# EAGLE design upper_final_2 (EAGLE 7.1.0)
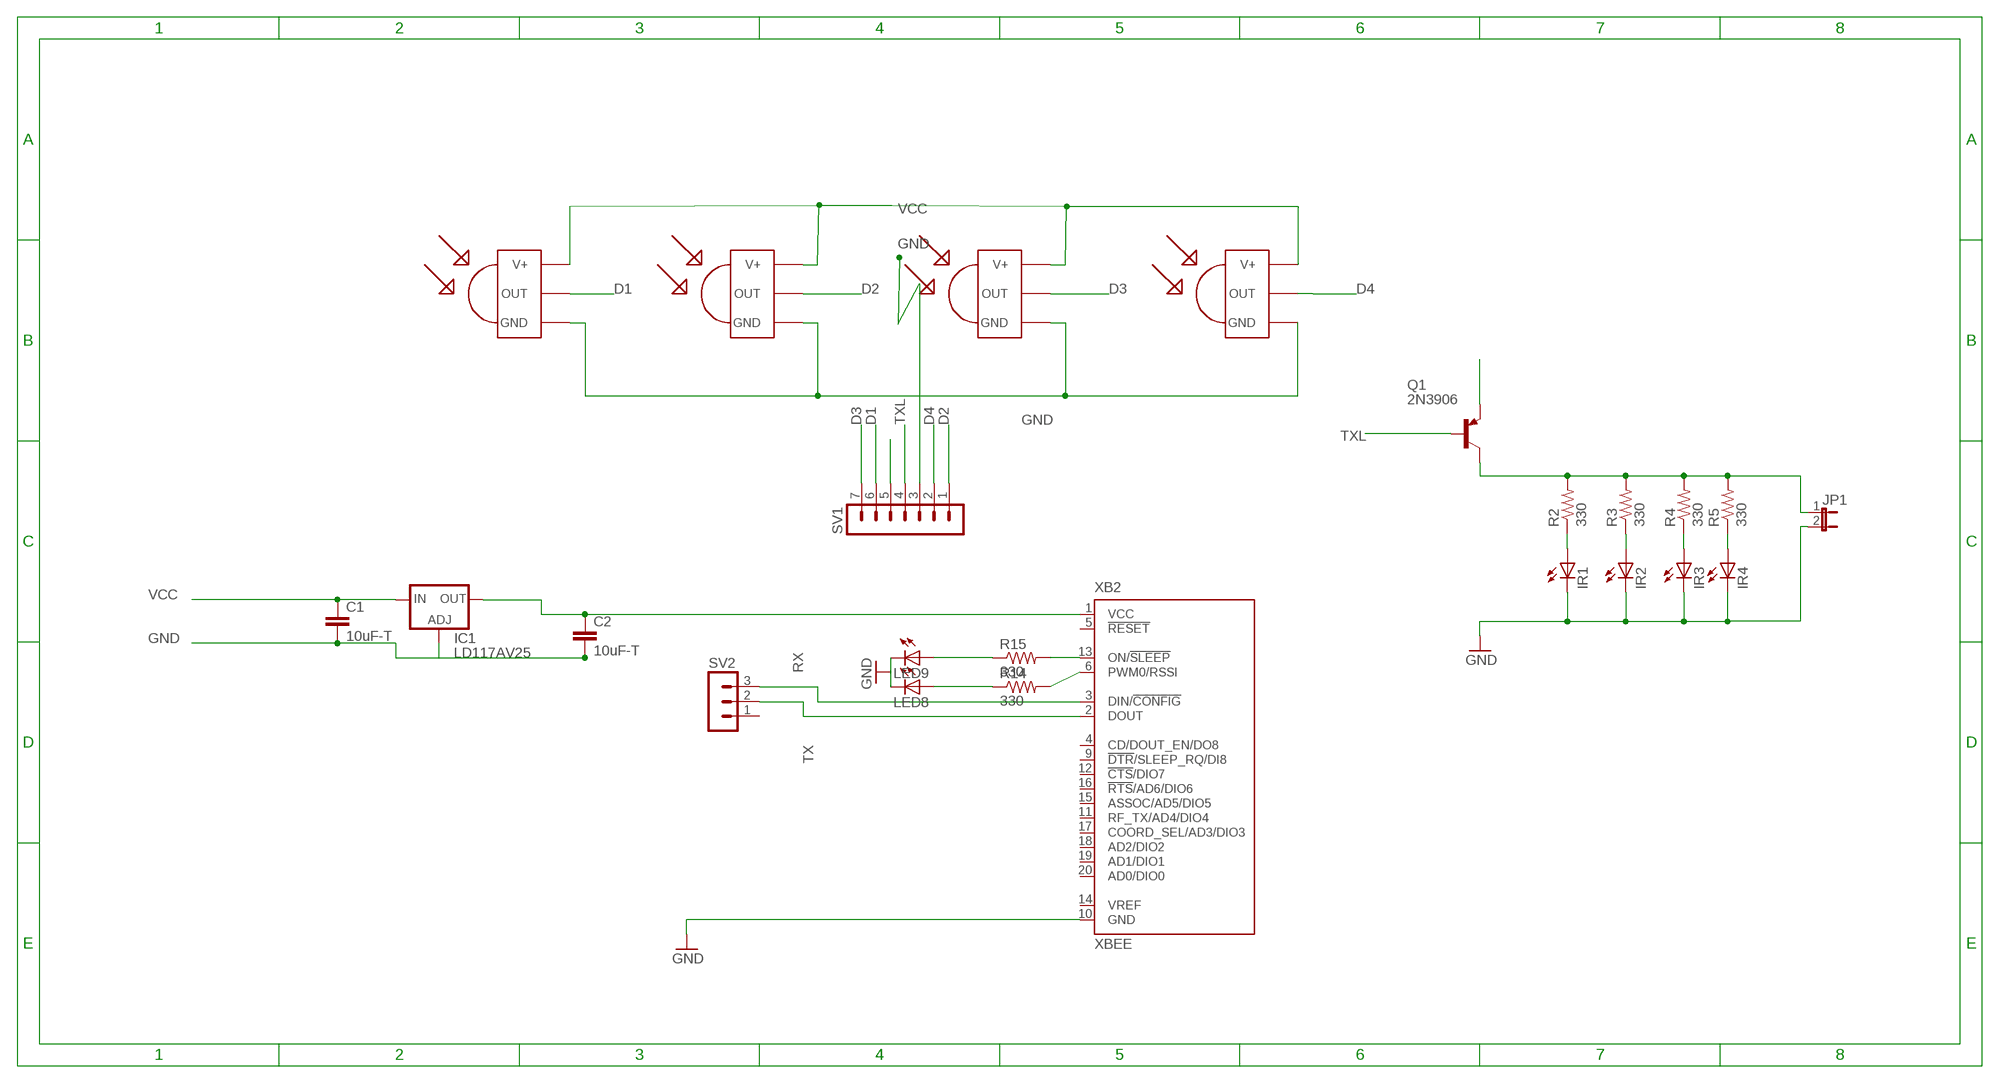
[diagram p0: schematic, sheet 1]

## Parts
C1  10uF-T  C-EU025-024X044  [C025-024X044]
C2  10uF-T  C-EU025-024X044  [C025-024X044]
IC1  LD117AV25  [TO220L1]
IR1  SFH482  [SFH482]
IR2  SFH482  [SFH482]
IR3  SFH482  [SFH482]
IR4  SFH482  [SFH482]
JP1  JP1E  [JP1]
LED8  LED3MM  [LED3MM]
LED9  LED3MM  [LED3MM]
Q1  2N3906  [TO92]
R2  330  R-US_0204/7  [0204/7]
R3  330  R-US_0204/7  [0204/7]
R4  330  R-US_0204/7  [0204/7]
R5  330  R-US_0204/7  [0204/7]
R14  330  R-US_0207/10  [0207/10]
R15  330  R-US_0207/10  [0207/10]
SV1  MA07-1  [MA07-1]
SV2  MA03-1  [MA03-1]
U$1  TSOP1738  [TSOP17XX]
U$2  TSOP1738  [TSOP17XX]
U$3  TSOP1738  [TSOP17XX]
U$4  TSOP1738  [TSOP17XX]
XB2  XBEE  [XBEE]

## Nets
D1: SV1.6 U$1.OUT
D2: SV1.1 U$2.OUT
D3: SV1.7 U$3.OUT
D4: SV1.2 U$4.OUT
GND: C1.2 C2.2 IC1.1(ADJ) IR1.K(C) IR2.K(C) IR3.K(C) IR4.K(C) JP1.2 LED8.K(C) LED9.K(C) SV1.3 U$1.GND U$2.GND U$3.GND U$4.GND XB2.10(GND)
N$3: IR1.A R2.1
N$4: IR2.A R3.1
N$5: IR3.A R4.1
N$6: IR4.A R5.1
N$7: JP1.1 Q1.1(C) R2.2 R3.2 R4.2 R5.2
N$19: R15.2 XB2.13(ON/!SLEEP)
N$29: C2.1 IC1.2(OUT) XB2.1(VCC)
N$31: LED8.A R14.1
N$32: LED9.A R15.1
N$33: R14.2 XB2.6(PWM0/RSSI)
RX: SV2.3 XB2.3(DIN/!CONFIG)
TX: SV2.2 XB2.2(DOUT)
TXL: Q1.2(B) SV1.4
VCC: C1.1 IC1.3(IN) Q1.3(E) SV1.5 U$1.V+ U$2.V+ U$3.V+ U$4.V+
Unconnected: SV2.1 XB2.4(CD/DOUT_EN/DO8) XB2.5(!RESET) XB2.9(!DTR!/SLEEP_RQ/DI8) XB2.11(RF_TX/AD4/DIO4) XB2.12(!CTS!/DIO7) XB2.14(VREF) XB2.15(ASSOC/AD5/DIO5) XB2.16(!RTS!/AD6/DIO6) XB2.17(COORD_SEL/AD3/DIO3) XB2.18(AD2/DIO2) XB2.19(AD1/DIO1) XB2.20(AD0/DIO0)

## Library data of the parts
C1 C2 = rcl:C-EU: CAPACITOR, European symbol
IC1 = v-reg:LD117A?*: Low drop fixed and adjustable positive voltage regulators 1 A Source: http://www.st.com/stonline/products/literature/ds/7194/ld1117axx.pdf
IR1-IR4 = led:SFH482: IR LED infrared emitting diode, Infineon
JP1 = jumper:JP1E: JUMPER
LED8 LED9 = led:LED: LED OSRAM: - CHIPLED LG R971, LG N971, LY N971, LG Q971, LY Q971, LO R971, LY R971 LH N974, LH R974 LS Q976, LO Q976, LY Q976 LO Q996 - Hyper CHIPLED LW Q18S LB Q993, LB Q99A, LB R99A - SideLED LS A670, LO A670, LY A670, LG A670, LP A670 LB A673, LV A673, LT A673, LW A673 LH A674 LY A675 LS A676, LA A676, LO A676, LY A676, LW A676 LS A679, LY A679, LG A679 - Hyper Micro SIDELED® LS Y876, LA Y876, LO Y876, LY Y876 LT Y87S - SmartLED LW L88C, LW L88S LB L89C, LB L89S, LG L890 LS L89K, LO L89K, LY L89K LS L896, LA L896, LO L896, LY L896 - TOPLED LS T670, LO T670, LY T670, LG T670, LP T670 LSG T670, LSP T670, LSY T670, LOP T670, LYG T670 LG T671, LOG T671, LSG T671 LB T673, LV T673, LT T673, LW T673 LH T674 LS T676, LA T676, LO T676, LY T676, LB T676, LH T676, LSB T676, LW T676 LB T67C, LV T67C, LT T67C, LS T67K, LO T67K, LY T67K, LW E67C LS E67B, LA E67B, LO E67B, LY E67B, LB E67C, LV E67C, LT E67C LW T67C LS T679, LY T679, LG T679 LS T770, LO T770, LY T770, LG T770, LP T770 LB T773, LV T773, LT T773, LW T773 LH T774 LS E675, LA E675, LY E675, LS T675 LS T776, LA T776, LO T776, LY T776, LB T776 LHGB T686 LT T68C, LB T68C - Hyper Mini TOPLED® LB M676 - Mini TOPLED Santana® LG M470 LS M47K, LO M47K, LY M47K Source: http://www.osram.convergy.de LUXEON: - LUMILED® LXK2-PW12-R00, LXK2-PW12-S00, LXK2-PW14-U00, LXK2-PW14-V00 LXK2-PM12-R00, LXK2-PM12-S00, LXK2-PM14-U00 LXK2-PE12-Q00, LXK2-PE12-R00, LXK2-PE12-S00, LXK2-PE14-T00, LXK2-PE14-U00 LXK2-PB12-K00, LXK2-PB12-L00, LXK2-PB12-M00, LXK2-PB14-N00, LXK2-PB14-P00, LXK2-PB14-Q00 LXK2-PR12-L00, LXK2-PR12-M00, LXK2-PR14-Q00, LXK2-PR14-R00 LXK2-PD12-Q00, LXK2-PD12-R00, LXK2-PD12-S00 LXK2-PH12-R00, LXK2-PH12-S00 LXK2-PL12-P00, LXK2-PL12-Q00, LXK2-PL12-R00 Source: www.luxeon.com KINGBRIGHT: KA-3528ASYC Source: www.kingbright.com
Q1 = transistor-pnp:2N3906: PNP Transistor
R2-R5 = resistor:R-US_: RESISTOR, American symbol
R14 R15 = rcl:R-US_: RESISTOR, American symbol
SV1 = con-lstb:MA07-1: PIN HEADER; OC_FARNELL: unknown; OC_NEWARK: unknown
SV2 = con-lstb:MA03-1: PIN HEADER; OC_FARNELL: unknown; OC_NEWARK: unknown
U$1-U$4 = tsop:TSOP1738: IR Receiver and Demodulator
XB2 = maxstream:XBEE: XBee (TM) /XBee-PRO(TM) OEM RF Modules Source: MaxStream, Inc. xbee_productmanual.pdf; MPN: XBP24-Z7UIT-004; OC_FARNELL: 1751799; OC_NEWARK: 34R5507

## Board
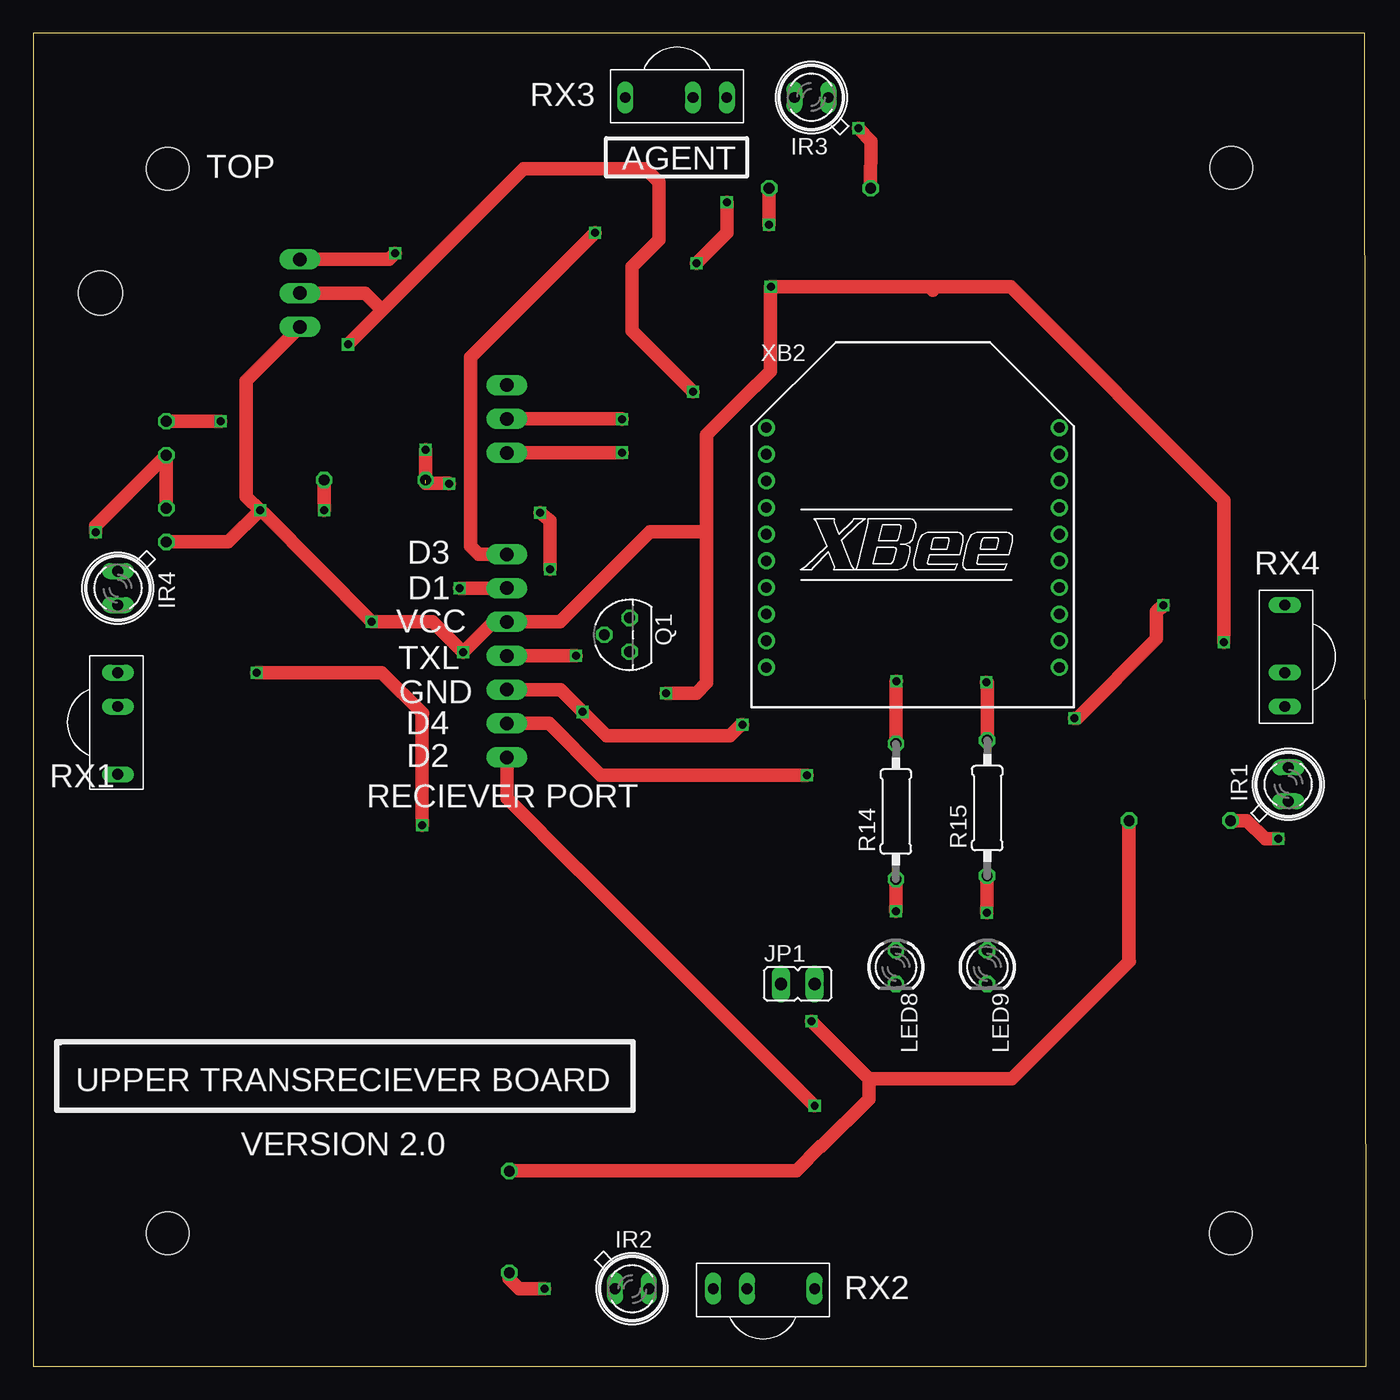
[diagram p1: board, top side]
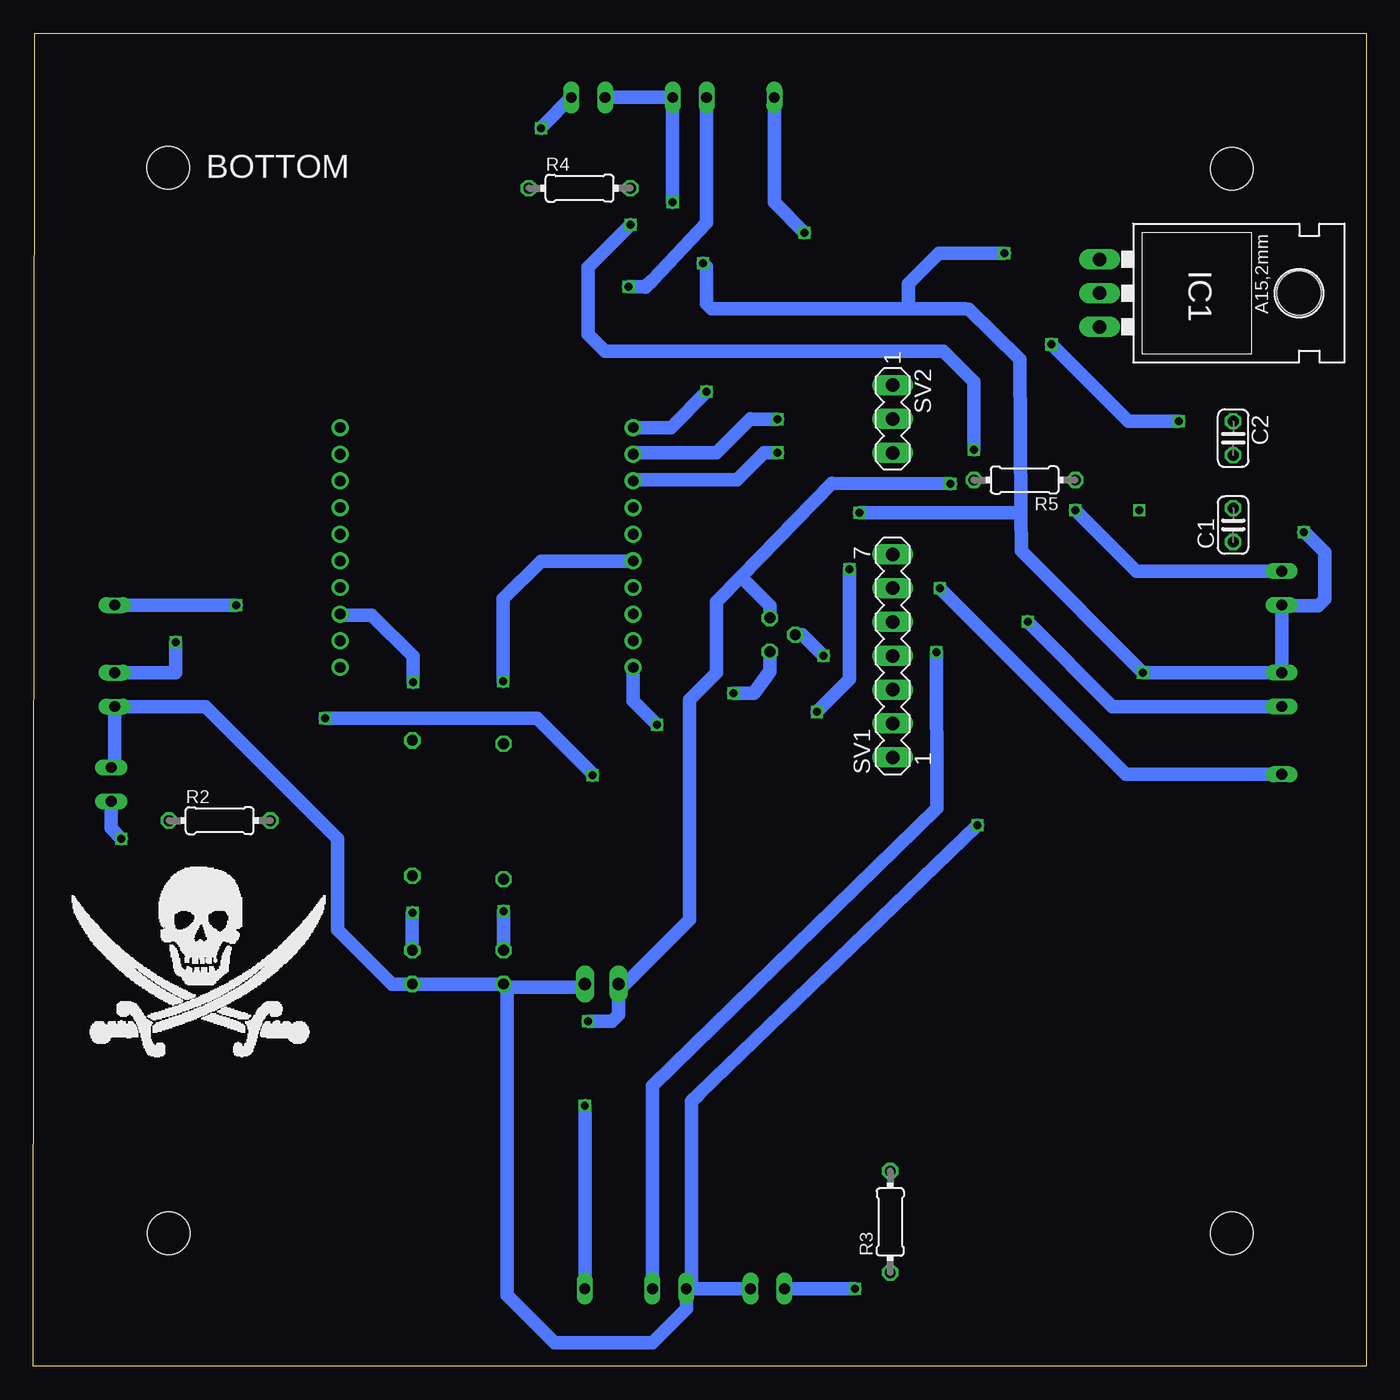
[diagram p2: board, bottom side, seen from below]

Size 100.08 x 100.07 mm. Coordinates in mm from the lower left corner, seen from the top.
Outline: 0,0 100.08,0 99.98,100.06 0,100.06 0,0
Copper layers (1*2*15*16): Top 0.035mm / dielectric 0.2mm / Route2 0.035mm / dielectric 1.2mm / Route15 0.035mm / dielectric 0.2mm / Bottom 0.035mm
Design rules "Elecrow_4-layer_PCB_eagle_rule": minimum track width 6mil, minimum drill 12mil, track to track 6mil, track to pad 6mil, pad to pad 6mil, via to via 8mil, smd to smd 0mil, copper to edge 20mil, drill to drill 10mil, minimum pad ring 6mil, minimum via ring 6mil, stop-mask expansion 0mil, vias tented up to drill 100mil, thermal gap 10mil
Holes 3.2 mm at 89.93,9.98 10.1,89.9 89.95,89.96 10.1,9.98

### Footprints (pad centres in the part's own frame; a part is rotated, then mirrored left to right if it is on the bottom)
C025-024X044 = drill 0.813 octagon: 1 -1.27,0; 2 1.27,0
TO220L1 = drill 1.016 long: 1 -2.54,-3.81; 2 0,-3.81; 3 2.54,-3.81 | hole 3.302: 0,11.176
SFH482 = drill 0.813 long: A -1.27,0; K 1.27,0
JP1 = drill 0.914 long: 1 0,-1.27; 2 0,1.27
LED3MM = drill 0.813 octagon: A -1.27,0; K 1.27,0
TO92 = drill 0.813 octagon: 1 1.27,0; 2 0,1.905; 3 -1.27,0
0204/7 = drill 0.813 octagon: 1 -3.81,0; 2 3.81,0
0207/10 = drill 0.813 octagon: 1 -5.08,0; 2 5.08,0
MA07-1 = drill 1.016 long: 1 -7.62,0; 2 -5.08,0; 3 -2.54,0; 4 0,0; 5 2.54,0; 6 5.08,0; 7 7.62,0
MA03-1 = drill 1.016 long: 1 -2.54,0; 2 0,0; 3 2.54,0
TSOP17XX = drill 0.813 long: GND -3.81,0; OUT 3.81,0; V+ -1.27,0
XBEE = drill 0.8 pad 1.27: 1 -11,9; 2 -11,7; 3 -11,5; 4 -11,3; 5 -11,1; 6 -11,-1; 7 -11,-3; 8 -11,-5; 9 -11,-7; 10 -11,-9; 11 11,-9; 12 11,-7; 13 11,-5; 14 11,-3; 15 11,-1; 16 11,1; 17 11,3; 18 11,5; 19 11,7; 20 11,9

### Placement (x,y rotation side)
C1  9.99,63.16 90 bottom
C2  9.99,69.67 270 bottom
IC1  16.22,80.56 270 bottom
IR1  94.23,43.69 90 top
IR2  44.96,5.84 0 top
IR3  58.42,95.25 180 top
IR4  6.35,58.42 270 top
JP1  57.4,28.7 270 top
LED8  64.77,29.97 270 top
LED9  71.63,29.97 270 top
Q1  44.78,54.91 90 top
R2  86.09,40.97 0 bottom
R3  35.74,10.85 90 bottom
R4  59.06,88.44 0 bottom
R5  25.65,66.53 180 bottom
R14  64.77,41.66 90 top
R15  71.63,41.91 90 top
SV1  35.56,53.34 90 bottom
SV2  35.56,71.12 270 bottom
U$1  6.35,48.26 270 top
U$2  54.86,5.84 0 top
U$3  48.26,95.25 180 top
U$4  93.98,53.34 90 top
XB2  66.04,61.47 0 top

### Tracks (layer width: path | path; a pad name or v marks a point on that pad's centre or on a via)
D1  (via drill 0.6)
  Top 1.016: v32,58.42 SV1.6
  Bottom 1.016: U$1.OUT 18.03,44.45 v32,58.42
D2  (via drill 0.6)
  Top 1.016: v58.67,19.56 40.89,37.34 40.87,37.34 35.56,42.65 SV1.1
  Bottom 1.016: v58.67,19.56 U$2.OUT
D3  (via drill 0.6)
  Top 1.016: v42.16,85.09 32.82,75.75 32.82,61.58 33.44,60.96 SV1.7
  Bottom 1.016: U$3.OUT 44.45,87.38 v42.16,85.09
D4  (via drill 0.6)
  Top 1.016: v84.84,57.15 84.33,56.64 84.33,54.61 78.38,48.66 v78.17,48.66 | SV1.2 38.71,48.26 42.6,44.37 v58.09,44.37
  Bottom 1.016: U$4.OUT v84.84,57.15 | v58.09,44.37 58.09,44.48 62.26,48.65 v78.16,48.65 v78.17,48.66
GND  (via drill 0.6)
  Top 1.016: v52.07,87.38 52.07,85.09 v49.78,82.8 | v38.05,64.08 38.81,63.49 38.81,63.2 38.81,63.03 v38.81,59.85 | v16.76,52.07 26.16,52.07 29.22,49.01 29.21,49 v29.21,40.62 | v53.24,48.16 53.14,48.16 52.32,47.35 43.03,47.35 v41.25,49.12 39.57,50.8 SV1.3 | v4.69,62.6 4.69,63.11 C2.2 C1.2 | C1.2 | IC1.1 26.72,83.1 v27.18,83.56
  Bottom 1.016: v52.07,87.38 U$3.GND IR3.K | IR1.K 93.98,45.21 U$4.GND 87.12,49.53 77.22,39.62 77.22,32.77 73.15,28.7 LED9.K LED8.K 64.52,28.45 | IR2.K U$2.GND | 25.93,64.16 26.01,75.62 29.84,79.35 30.12,79.4 34.12,79.4 | 25.93,64.16 25.91,61.21 v16.76,52.07 U$1.GND IR4.K 6.3,57.1 3.6,57.1 3.1,57.6 3.1,61.1 4.6,62.6 v4.69,62.6 | v29.21,40.62 50.11,20.47 50.11,20.45 50.65,19.91 50.65,6.25 U$2.GND | U$2.GND 51.05,4.32 53.59,1.78 60.96,1.78 64.52,5.33 64.52,28.45 | 64.52,28.45 58.93,28.45 JP1.2 | 34.12,79.4 49.17,79.4 49.53,79.76 49.53,82.55 v49.78,82.8 | v38.81,59.85 38.81,51.56 v41.25,49.12 | v38.05,64.08 26.01,64.08 25.93,64.16 | XB2.10 55.04,49.96 v53.24,48.16 | v27.18,83.56 32.09,83.56 34.37,81.27 34.37,79.65 34.12,79.4
N$3  (via drill 0.6)
  Top 1.016: v93.47,39.62 92.52,39.62 92.5,39.6 91.13,40.97 R2.1
  Bottom 1.016: v93.47,39.62 94.23,40.39 IR1.A
N$4  (via drill 0.6)
  Top 1.016: R3.1 35.74,6.59 36.49,5.84 v38.4,5.84
  Bottom 1.016: IR2.A 41.07,5.84 40.93,5.84 v38.4,5.84
N$5  (via drill 0.6)
  Top 1.016: R4.1 62.88,91.95 v61.96,92.95
  Bottom 1.016: v61.96,92.95 61.82,93.12 IR3.A
N$6  (via drill 0.6)
  Top 1.016: v21.84,64.26 R5.1
  Bottom 1.016: IR4.A 17.27,59.69 v21.84,64.26
N$7  (via drill 0.6)  (1 unrouted)
  Top 1.016: 62.74,21.59 62.74,20.07 59.18,16.51 59.11,16.51 57.3,14.7 35.78,14.7 R3.2 | 62.74,21.59 v58.42,25.91 | 62.74,21.59 73.49,21.59 82.3,30.4 82.28,30.4 R2.2 | v55.25,85.69 R4.2 | 29.47,66.29 31.17,66.29 v31.21,66.24 | R5.2 v29.46,68.79
  Bottom 1.016: 46.96,59.27 40.13,66.29 v31.21,66.24 | 46.96,59.27 48.77,57.4 48.77,52.07 50.8,50.04 50.8,33.53 56.13,28.19 | v58.42,25.91 56.64,25.91 56.13,26.42 56.13,28.19 | 56.13,28.19 JP1.1 | Q1.1 44.78,57.09 46.96,59.27 | v29.46,68.79 29.46,69.41 29.46,73.91 31.75,76.2 57.15,76.2 58.42,77.47 58.42,82.52 v55.25,85.69
N$19  (via drill 0.6)
  Top 1.016: R15.2 71.63,51.3 v71.58,51.35
  Bottom 1.016: XB2.13 76.96,56.39 74.68,56.39 71.58,53.29 v71.58,51.35
N$29  (via drill 0.6)
  Top 1.016: v49.53,73.15 44.96,77.72 44.96,82.55 46.99,84.58 46.99,88.9 45.97,89.92 36.83,89.92 26.2,79.28 | 26.2,79.28 v23.62,76.71 | C2.1 12.19,70.94 v14.05,70.94 | IC1.2 24.92,80.56 26.2,79.28
  Bottom 1.016: XB2.1 52.21,70.47 v49.53,73.15 | 22.2,75.3 22.21,75.3 | 22.21,75.3 v23.62,76.71 | 22.21,75.3 17.86,70.94 v14.05,70.94
N$31  (via drill 0.6)
  Top 1.016: v64.76,34.17 64.76,36.57 R14.1
  Bottom 1.016: LED8.A v64.77,34.16 v64.76,34.17
N$32  (via drill 0.6)
  Top 1.016: v71.6,34.06 71.6,36.8 R15.1
  Bottom 1.016: LED9.A 71.63,34.03 v71.6,34.06
N$33  (via drill 0.6)
  Top 1.016: R14.2 64.77,51.39 v64.8,51.42
  Bottom 1.016: XB2.6 55.06,60.45 61.98,60.45 64.8,57.63 v64.8,51.42
RX  (via drill 0.6)
  Top 1.016: SV2.3 44.18,68.58 v44.2,68.6
  Bottom 1.016: XB2.3 54.96,66.55 47.24,66.55 45.6,68.2 45.21,68.58 45.19,68.6 v44.2,68.6
TX  (via drill 0.6)
  Top 1.016: SV2.2 44.18,71.12 v44.2,71.1
  Bottom 1.016: XB2.2 54.93,68.58 48.77,68.58 46.23,71.12 46.21,71.1 v44.2,71.1
TXL  (via drill 0.6)
  Top 1.016: SV1.4 v40.77,53.34
  Bottom 1.016: Q1.2 42.34,54.91 v40.77,53.34
VCC  (via drill 0.6)
  Top 1.016: 67.31,81.03 v55.37,81.03 v55.37,81.02 55.37,74.71 54.28,73.62 54.24,73.62 50.55,69.93 50.55,62.65 | 67.31,81.03 73.41,81.03 89.41,65.02 v89.41,54.36 | 67.56,80.77 67.31,81.03 | v47.5,50.55 49.78,50.55 50.55,51.31 50.55,62.39 | v17.02,64.26 17.4,63.98 v25.4,55.88 29.97,55.88 v32.26,53.59 34.54,55.88 SV1.5 39.54,55.88 46.31,62.65 50.55,62.65 | 50.55,62.39 50.55,62.65 | 50.29,62.65 50.55,62.39 | v17.02,64.26 16,65.28 16,74 IC1.3 | C1.1 14.64,61.88 v17.02,64.26
  Bottom 1.016: U$1.V+ 19.05,49.53 v25.4,55.88 | U$3.V+ 49.53,85.85 53.59,81.53 54.1,81.03 | U$4.V+ 89.41,52.07 v89.41,54.36 | 54.13,81 54.1,81.03 | 54.1,81.03 v55.37,81.03 | U$2.V+ 53.59,21.08 32.23,41.88 v32.26,53.59 | v47.5,50.55 45.97,50.55 44.78,52.16 44.78,52.25 Q1.3

### Text on the board
tPlace: RX3 | RX4 | RX1 | VERSION 2.0 | RX2
tNames: AGENT | TOP | D3 | D1 | VCC | TXL | GND | D4 | D2 | RECIEVER PORT | UPPER TRANSRECIEVER BOARD
bNames: BOTTOM